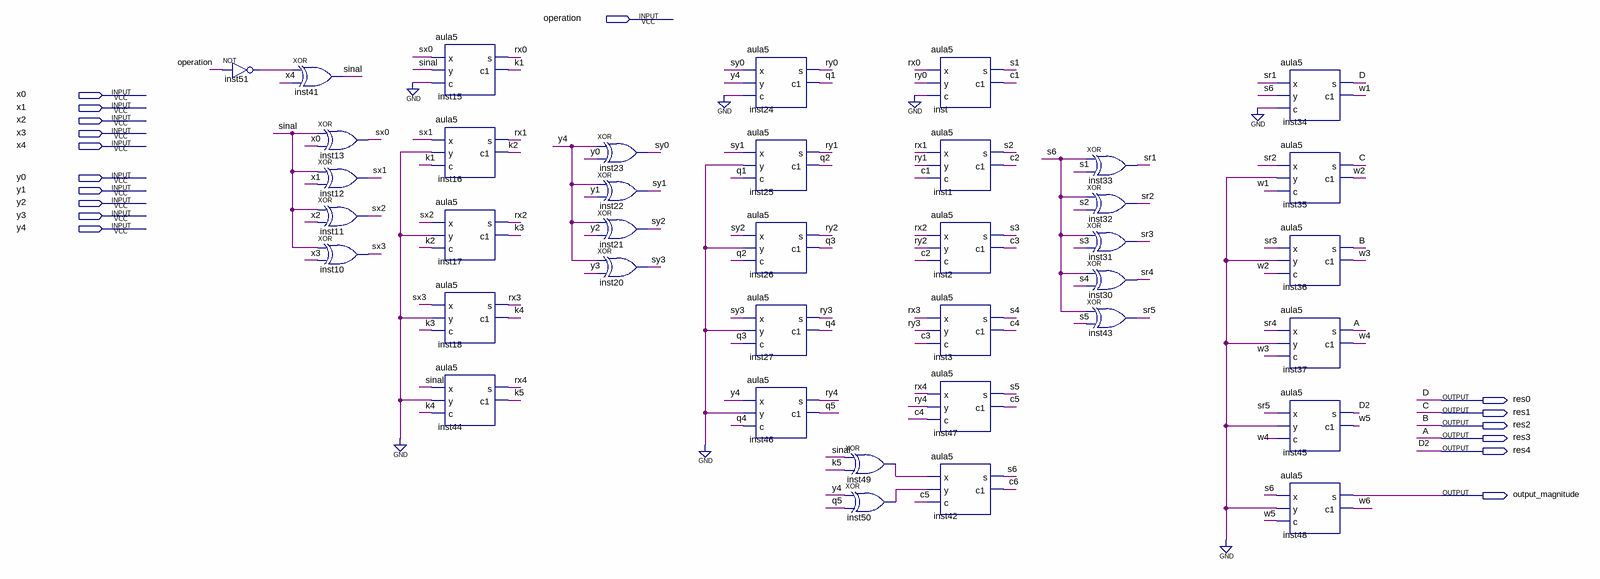
[diagram p0: schematic sheet]
// Quartus schematic twos_complement_adder.bdf as structural Verilog: 39 symbols, 17 pins
module twos_complement_adder (
  input  operation,
  input  x0,
  input  x1,
  input  x2,
  input  x3,
  input  x4,
  input  y0,
  input  y1,
  input  y2,
  input  y3,
  input  y4,
  output res0,
  output res1,
  output res2,
  output res3,
  output res4,
  output output_magnitude
);

  wire c1, c2, c3, c4, c5, c6, inst49_out, inst50_out, inst51_out, k1, k2, k3, k4, k5, q1, q2, q3, q4, q5,
       rx0, rx1, rx2, rx3, rx4, ry0, ry1, ry2, ry3, ry4, s1, s2, s3, s4, s5, s6, sinal, sr1, sr2, sr3, sr4,
       sr5, sx0, sx1, sx2, sx3, sy0, sy1, sy2, sy3, w1, w2, w3, w4, w5, w6;

  not inst51 (inst51_out, operation);
  xor inst41 (sinal, inst51_out, x4);
  xor inst13 (sx0, sinal, x0);
  xor inst12 (sx1, sinal, x1);
  xor inst11 (sx2, sinal, x2);
  xor inst10 (sx3, sinal, x3);
  aula5 inst15 (.x(sx0), .y(sinal), .c(1'b0), .s(rx0), .c1(k1));
  aula5 inst16 (.x(sx1), .y(1'b0), .c(k1), .s(rx1), .c1(k2));
  aula5 inst17 (.x(sx2), .y(1'b0), .c(k2), .s(rx2), .c1(k3));
  aula5 inst18 (.x(sx3), .y(1'b0), .c(k3), .s(rx3), .c1(k4));
  aula5 inst44 (.x(sinal), .y(1'b0), .c(k4), .s(rx4), .c1(k5));
  xor inst23 (sy0, y4, y0);
  xor inst22 (sy1, y4, y1);
  xor inst21 (sy2, y4, y2);
  xor inst20 (sy3, y4, y3);
  aula5 inst24 (.x(sy0), .y(y4), .c(1'b0), .s(ry0), .c1(q1));
  aula5 inst25 (.x(sy1), .y(1'b0), .c(q1), .s(ry1), .c1(q2));
  aula5 inst26 (.x(sy2), .y(1'b0), .c(q2), .s(ry2), .c1(q3));
  aula5 inst27 (.x(sy3), .y(1'b0), .c(q3), .s(ry3), .c1(q4));
  aula5 inst46 (.x(y4), .y(1'b0), .c(q4), .s(ry4), .c1(q5));
  xor inst49 (inst49_out, sinal, k5);
  xor inst50 (inst50_out, y4, q5);
  aula5 inst (.x(rx0), .y(ry0), .c(1'b0), .s(s1), .c1(c1));
  aula5 inst1 (.x(rx1), .y(ry1), .c(c1), .s(s2), .c1(c2));
  aula5 inst2 (.x(rx2), .y(ry2), .c(c2), .s(s3), .c1(c3));
  aula5 inst3 (.x(rx3), .y(ry3), .c(c3), .s(s4), .c1(c4));
  aula5 inst47 (.x(rx4), .y(ry4), .c(c4), .s(s5), .c1(c5));
  aula5 inst42 (.x(inst49_out), .y(inst50_out), .c(c5), .s(s6), .c1(c6));
  xor inst33 (sr1, s6, s1);
  xor inst32 (sr2, s6, s2);
  xor inst31 (sr3, s6, s3);
  xor inst30 (sr4, s6, s4);
  xor inst43 (sr5, s6, s5);
  aula5 inst34 (.x(sr1), .y(s6), .c(1'b0), .s(res0), .c1(w1));
  aula5 inst35 (.x(sr2), .y(1'b0), .c(w1), .s(res1), .c1(w2));
  aula5 inst36 (.x(sr3), .y(1'b0), .c(w2), .s(res2), .c1(w3));
  aula5 inst37 (.x(sr4), .y(1'b0), .c(w3), .s(res3), .c1(w4));
  aula5 inst45 (.x(sr5), .y(1'b0), .c(w4), .s(res4), .c1(w5));
  aula5 inst48 (.x(s6), .y(1'b0), .c(w5), .s(output_magnitude), .c1(w6));

  // Other names for the same wires on the sheet: A = res3; B = res2; C = res1; D = res0; D2 = res4
endmodule
